# Altium schematic sheet 11_RS232_2.SchDoc
size A3
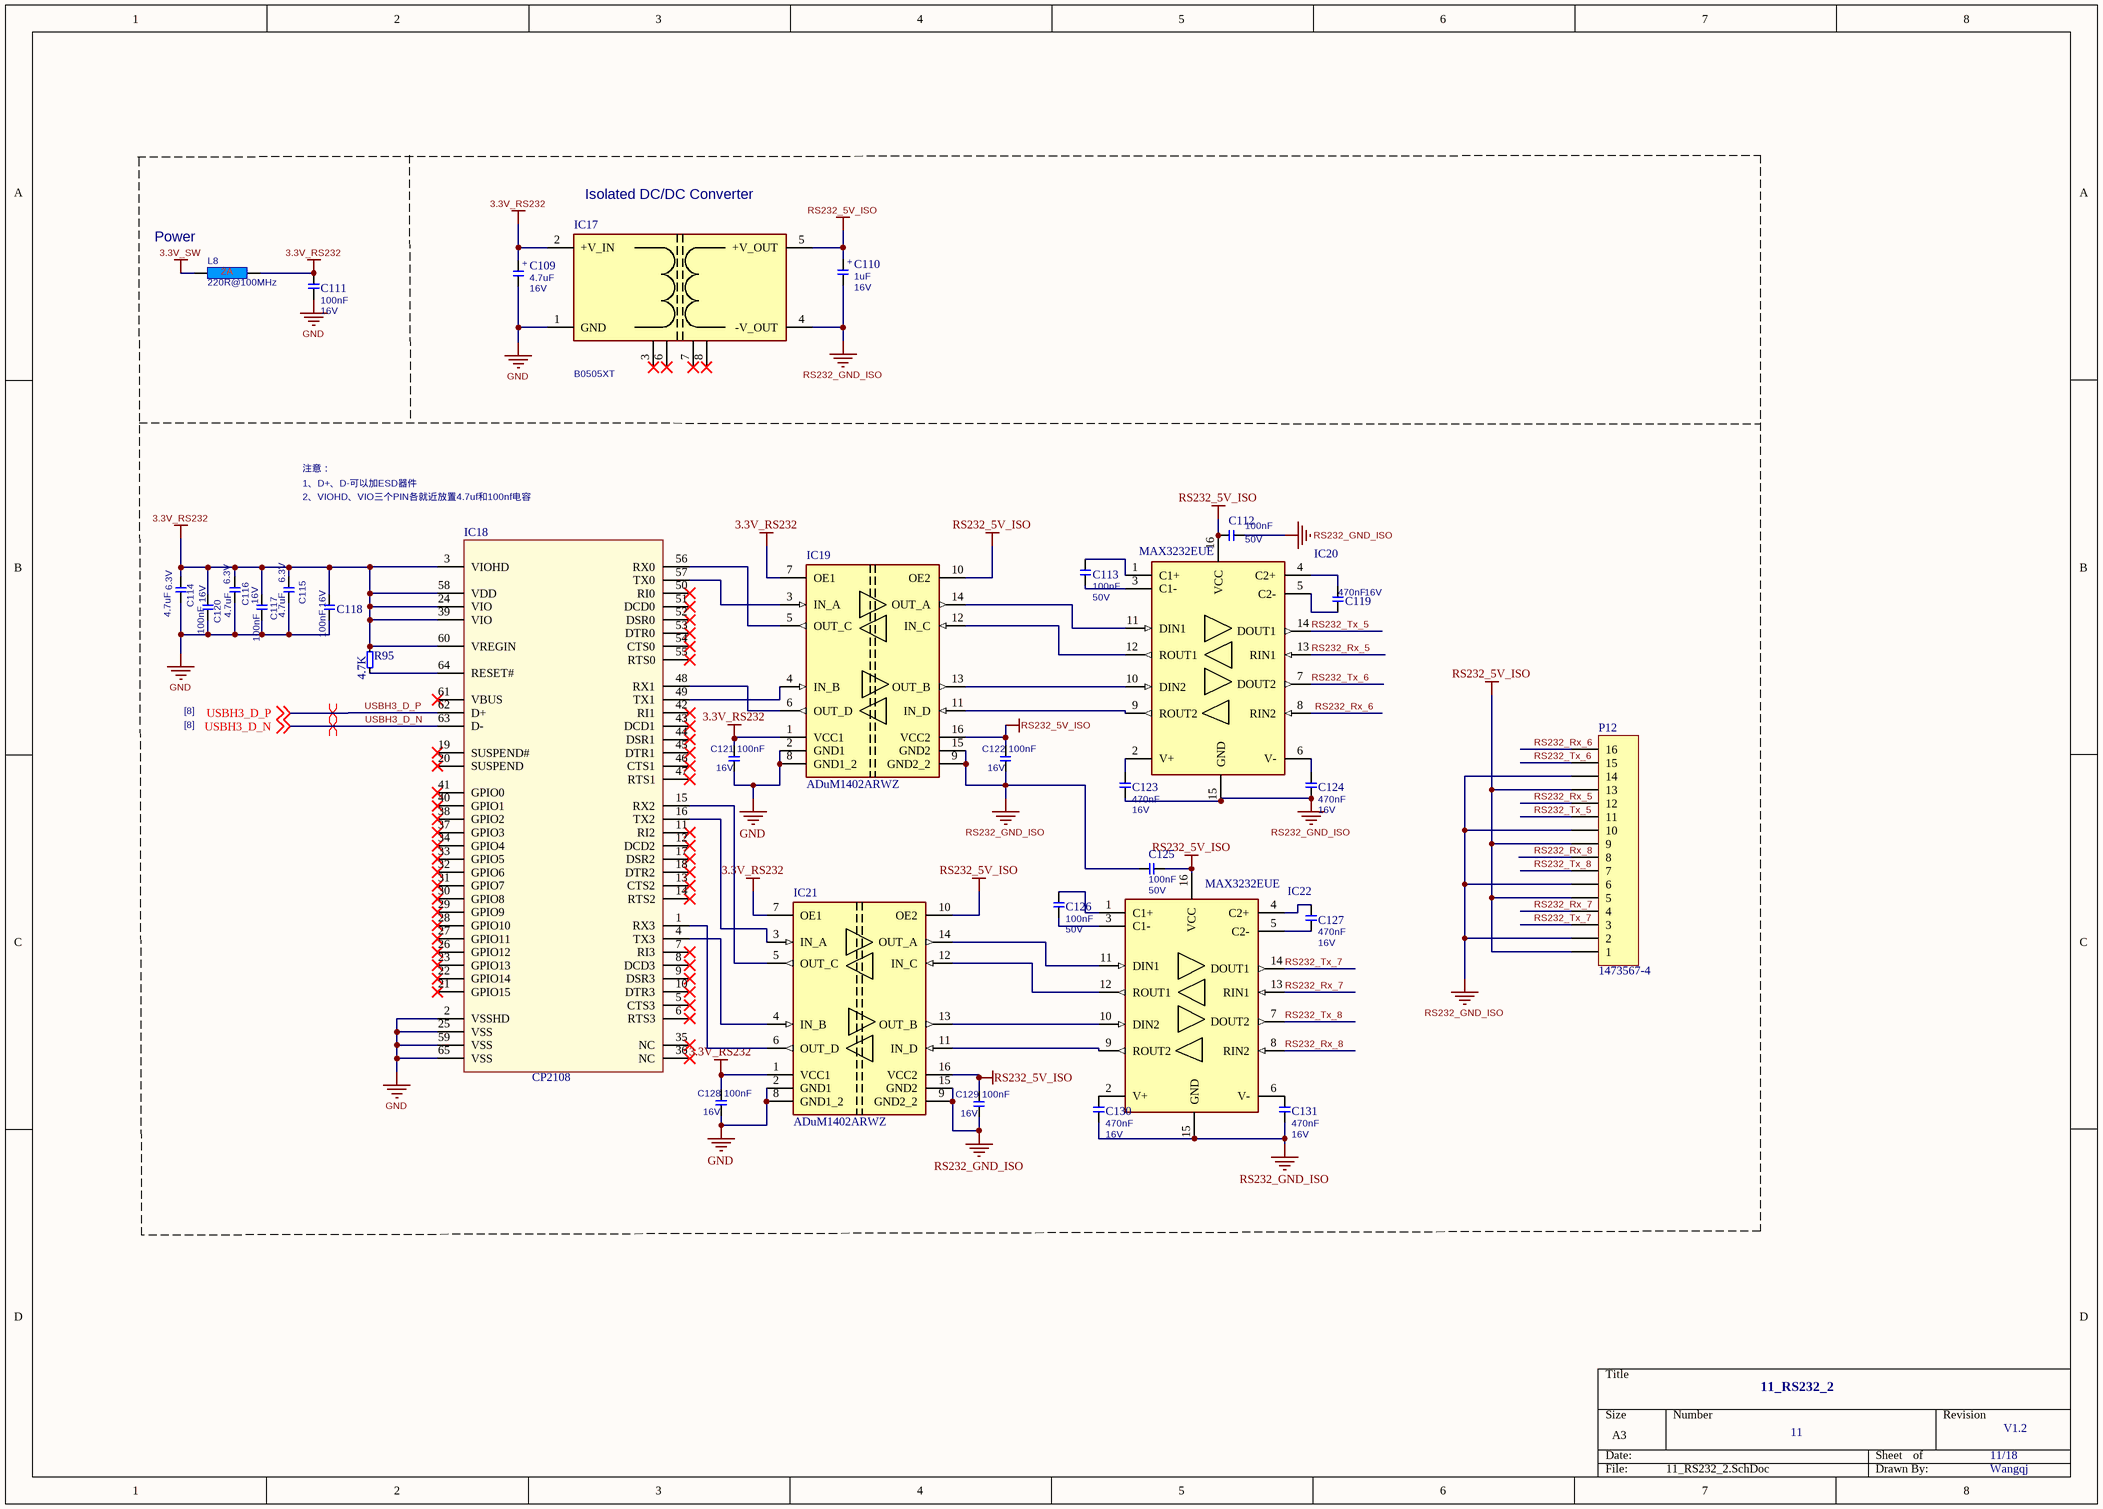
[diagram p0: 11_RS232_2.SchDoc]

## Parts
C109  Rating: 16V  [T_CAPMP3216X180N]  (hidden comment: 4.7uF)
C110  Rating: 16V  [T_CAPMP3216X180N]  (hidden comment: 1uF)
C111  Rating: 16V  [T_CAPC0603X33N]  (hidden comment: 100nF)
C112  Rating: 50V  [T_CAPC0603X33N]  (hidden comment: 100nF)
C113  Rating: 50V  [T_CAPC0603X33N]  (hidden comment: 100nF)
C114  Rating: 6.3V  [T_CAPC0603X33N]  (hidden comment: 4.7uF)
C115  Rating: 6.3V  [T_CAPC0603X33N]  (hidden comment: 4.7uF)
C116  Rating: 6.3V  [T_CAPC0603X33N]  (hidden comment: 4.7uF)
C117  Rating: 16V  [T_CAPC0603X33N]  (hidden comment: 100nF)
C118  Rating: 16V  [T_CAPC0603X33N]  (hidden comment: 100nF)
C119  Rating: 16V  [T_CAPC0603X33N]  (hidden comment: 470nF)
C120  Rating: 16V  [T_CAPC0603X33N]  (hidden comment: 100nF)
C121  Rating: 16V  [T_CAPC0603X33N]  (hidden comment: 100nF)
C122  Rating: 16V  [T_CAPC0603X33N]  (hidden comment: 100nF)
C123  Rating: 16V  [T_CAPC0603X33N]  (hidden comment: 470nF)
C124  Rating: 16V  [T_CAPC0603X33N]  (hidden comment: 470nF)
C125  Rating: 50V  [T_CAPC0603X33N]  (hidden comment: 100nF)
C126  Rating: 50V  [T_CAPC0603X33N]  (hidden comment: 100nF)
C127  Rating: 16V  [T_CAPC0603X33N]  (hidden comment: 470nF)
C128  Rating: 16V  [T_CAPC0603X33N]  (hidden comment: 100nF)
C129  Rating: 16V  [T_CAPC0603X33N]  (hidden comment: 100nF)
C130  Rating: 16V  [T_CAPC0603X33N]  (hidden comment: 470nF)
C131  Rating: 16V  [T_CAPC0603X33N]  (hidden comment: 470nF)
IC17  Manufacturer Part No.: B0505XT  [MORNSUN_B0305XT-1W_SMD]  (hidden comment: B0505XT-1W)
IC18  CP2108  [QFN50P900X900X90_HS-65N]
IC19  ADuM1402ARWZ  [T_AD_ADuM1300ARW]
IC20  MAX3232EUE  [LC-TSSOP-16]
IC21  ADuM1402ARWZ  [T_AD_ADuM1300ARW]
IC22  MAX3232EUE  [LC-TSSOP-16]
L8  220R@100MHz  [INDC1608X95N]
P12  1473567-4  [147-4]
R95  4.7K  [t_RESC0603X30N]

## Nets
3.3V_RS232: C109.1 C111.2 C114.2 C115.2 C116.2 C117.2 C118.2 C120.2 C121.2 C128.2 IC17.2(+V_IN) IC18.3(VIOHD) IC18.24(VIO) IC18.39(VIO) IC18.58(VDD) IC18.60(VREGIN) IC19.1(VCC1) IC19.7(OE1) IC21.1(VCC1) IC21.7(OE1) L8.2 R95.2
3.3V_SW: L8.1
GND: C109.2 C111.1 C114.1 C115.1 C116.1 C117.1 C118.1 C120.1 C121.1 C128.1 IC17.1(GND) IC18.2(VSSHD) IC18.25(VSS) IC18.59(VSS) IC18.65(VSS) IC19.2(GND1) IC19.8(GND1_2) IC21.2(GND1) IC21.8(GND1_2)
RS232_5V_ISO: C110.1 C112.2 C122.2 C125.1 C129.2 IC17.5(+V_OUT) IC19.10(OE2) IC19.16(VCC2) IC20.16(VCC) IC21.10(OE2) IC21.16(VCC2) IC22.16(VCC) P12.1 P12.5 P12.9 P12.13
RS232_GND_ISO: C110.2 C112.1 C122.1 C123.1 C124.1 C125.2 C129.1 C130.1 C131.1 IC17.4(-V_OUT) IC19.9(GND2_2) IC19.15(GND2) IC20.15(GND) IC21.9(GND2_2) IC21.15(GND2) IC22.15(GND) P12.2 P12.6 P12.10 P12.14
RS232_Rx_5: IC20.13(RIN1) P12.12
RS232_Rx_6: IC20.8(RIN2) P12.16
RS232_Rx_7: IC22.13(RIN1) P12.4
RS232_Rx_8: IC22.8(RIN2) P12.8
RS232_Tx_5: IC20.14(DOUT1) P12.11
RS232_Tx_6: IC20.7(DOUT2) P12.15
RS232_Tx_7: IC22.14(DOUT1) P12.3
RS232_Tx_8: IC22.7(DOUT2) P12.7
USBH3_D_N: IC18.63(D-) ; off-sheet USBH3_D_N
USBH3_D_P: IC18.62(D+) ; off-sheet USBH3_D_P
NetC113_1: C113.1 IC20.3(C1-)
NetC113_2: C113.2 IC20.1(C1+)
NetC119_1: C119.1 IC20.5(C2-)
NetC119_2: C119.2 IC20.4(C2+)
NetC123_2: C123.2 IC20.2(V+)
NetC124_2: C124.2 IC20.6(V-)
NetC126_1: C126.1 IC22.3(C1-)
NetC126_2: C126.2 IC22.1(C1+)
NetC127_1: C127.1 IC22.5(C2-)
NetC127_2: C127.2 IC22.4(C2+)
NetC130_2: C130.2 IC22.2(V+)
NetC131_2: C131.2 IC22.6(V-)
NetIC18_1: IC18.1(RX3) IC21.6(OUT_D)
NetIC18_4: IC18.4(TX3) IC21.4(IN_B)
NetIC18_15: IC18.15(RX2) IC21.5(OUT_C)
NetIC18_16: IC18.16(TX2) IC21.3(IN_A)
NetIC18_48: IC18.48(RX1) IC19.6(OUT_D)
NetIC18_49: IC18.49(TX1) IC19.4(IN_B)
NetIC18_56: IC18.56(RX0) IC19.5(OUT_C)
NetIC18_57: IC18.57(TX0) IC19.3(IN_A)
NetIC18_64: IC18.64(RESET#) R95.1
NetIC19_11: IC19.11(IN_D) IC20.9(ROUT2)
NetIC19_12: IC19.12(IN_C) IC20.12(ROUT1)
NetIC19_13: IC19.13(OUT_B) IC20.10(DIN2)
NetIC19_14: IC19.14(OUT_A) IC20.11(DIN1)
NetIC21_11: IC21.11(IN_D) IC22.9(ROUT2)
NetIC21_12: IC21.12(IN_C) IC22.12(ROUT1)
NetIC21_13: IC21.13(OUT_B) IC22.10(DIN2)
NetIC21_14: IC21.14(OUT_A) IC22.11(DIN1)

Not connected (* = marked no-connect by the designer): IC17 3(NC)* 6(NC)* 7(NC)* 8(NC)*; IC18 5(CTS3)* 6(RTS3)* 7(RI3)* 8(DCD3)* 9(DSR3)* 10(DTR3)* 11(RI2)* 12(DCD2)* 13(CTS2)* 14(RTS2)* 17(DSR2)* 18(DTR2)* 19(SUSPEND#)* 20(SUSPEND)* 21(GPIO15)* 22(GPIO14)* 23(GPIO13)* 26(GPIO12)* 27(GPIO11)* 28(GPIO10)* 29(GPIO9)* 30(GPIO8)* 31(GPIO7)* 32(GPIO6)* 33(GPIO5)* 34(GPIO4)* 35(NC)* 36(NC)* 37(GPIO3)* 38(GPIO2)* 40(GPIO1)* 41(GPIO0)* 42(RI1)* 43(DCD1)* 44(DSR1)* 45(DTR1)* 46(CTS1)* 47(RTS1)* 50(RI0)* 51(DCD0)* 52(DSR0)* 53(DTR0)* 54(CTS0)* 55(RTS0)* 61(VBUS)*

## Layout directives
differential pair: USBH3_D_N, USBH3_D_P

## Notes on the sheet
- (near L8) Power
- (near IC17) Isolated DC/DC Converter
- 注意：
- 1、D+、D-可以加ESD器件
- 2、VIOHD、VIO三个PIN各就近放置4.7uf和100nf电容
- [8]
- 11_RS232_2
- 11
- 11/18
- V1.2
- Wangqj
- (in symbol C-1uF-16V-10%-3216-TA) +
- (in symbol C-4.7uF-16V-10%-3216-TA) +

## Library data of the parts
C109 = C-4.7uF-16V-10%-3216-TA: Capacitor TA 4.7uF 16V 10% 3216; Tolerance: 10%; Type: TA; Value: 4.7uF
C110 = C-1uF-16V-10%-3216-TA: Capacitor TA 1uF 16V 10% 3216; Tolerance: 10%; Type: TA; Value: 1uF
C111 C117 C118 C120 = C-100nF-16V-10%-0603-X7R: Capacitor Ceramic X7R 100nF 16V 10% 0603; Tolerance: 10%; Type: X7R; Value: 100nF
C112 C113 C125 C126 = C-X7R-100nF-50V-20%-0603: Capacitor Ceramic X7R 100nF 50V 20% 0603; Tolerance: 20%; Type: X7R; Value: 100nF
C114-C116 = C-4.7uF-6.3V-20%-0603-X5R: Capacitor Ceramic X5R 4.7uF 6.3V 20% 0603; Tolerance: 20%; Type: X5R; Value: 4.7uF
C119 C123 C124 C127 C130 C131 = C-X7R-470nF-16V-10%-0603: Capacitor Ceramic X7R 470nF 16V 10% 0603; Type: X7R; Tolerance: 10%; Value: 470nF
C121 C122 C128 C129 = C-X7R-100nF-16V-10%-0603: Capacitor Ceramic X7R 100nF 16V 10% 0603; Tolerance: 10%; Type: X7R; Value: 100nF
IC17 = IC-MORNSUN-B0505XT-SMD: MORNSUN Isolated DC/DC Converter; Manufacturer Name: Murata
IC18 = IC-SILICON-CP2108: Single-Chip USB To Quad UART Bridge; Manufacturer Name: SILICON LABS; Manucfacturer Part NO.: CP2108
IC19 IC21 = IC-AD-ADuM1402ARWZ: Digital Isolator
IC20 IC22 = IC-MAXIM-MAX3232: RS232
L8 = L-220R@100MHz-2A-25%-0603: 220R@100MHz 2A EMI FILTER; Tolerance: 25%; Rating: 2A; Value: 220R@100MHz
P12 = MHDR1X16: 泰科4P端子; LatestRevisionDate: 17-Jul-2002; LatestRevisionNote: Re-released for DXP Platform.; Publisher: Altium Limited
R95 = R-4.7kR-63mW-5%-0603: Resistor 4.7 Kohm 63mW 5% 0603; Value: 4.7KR; Rating: 63mW; Tolerance: 5%